# Altium schematic sheet 05_ZYNQ_BANK0_1_34_35.SchDoc
size A4; SheetNumber: 6; SheetTotal: 11
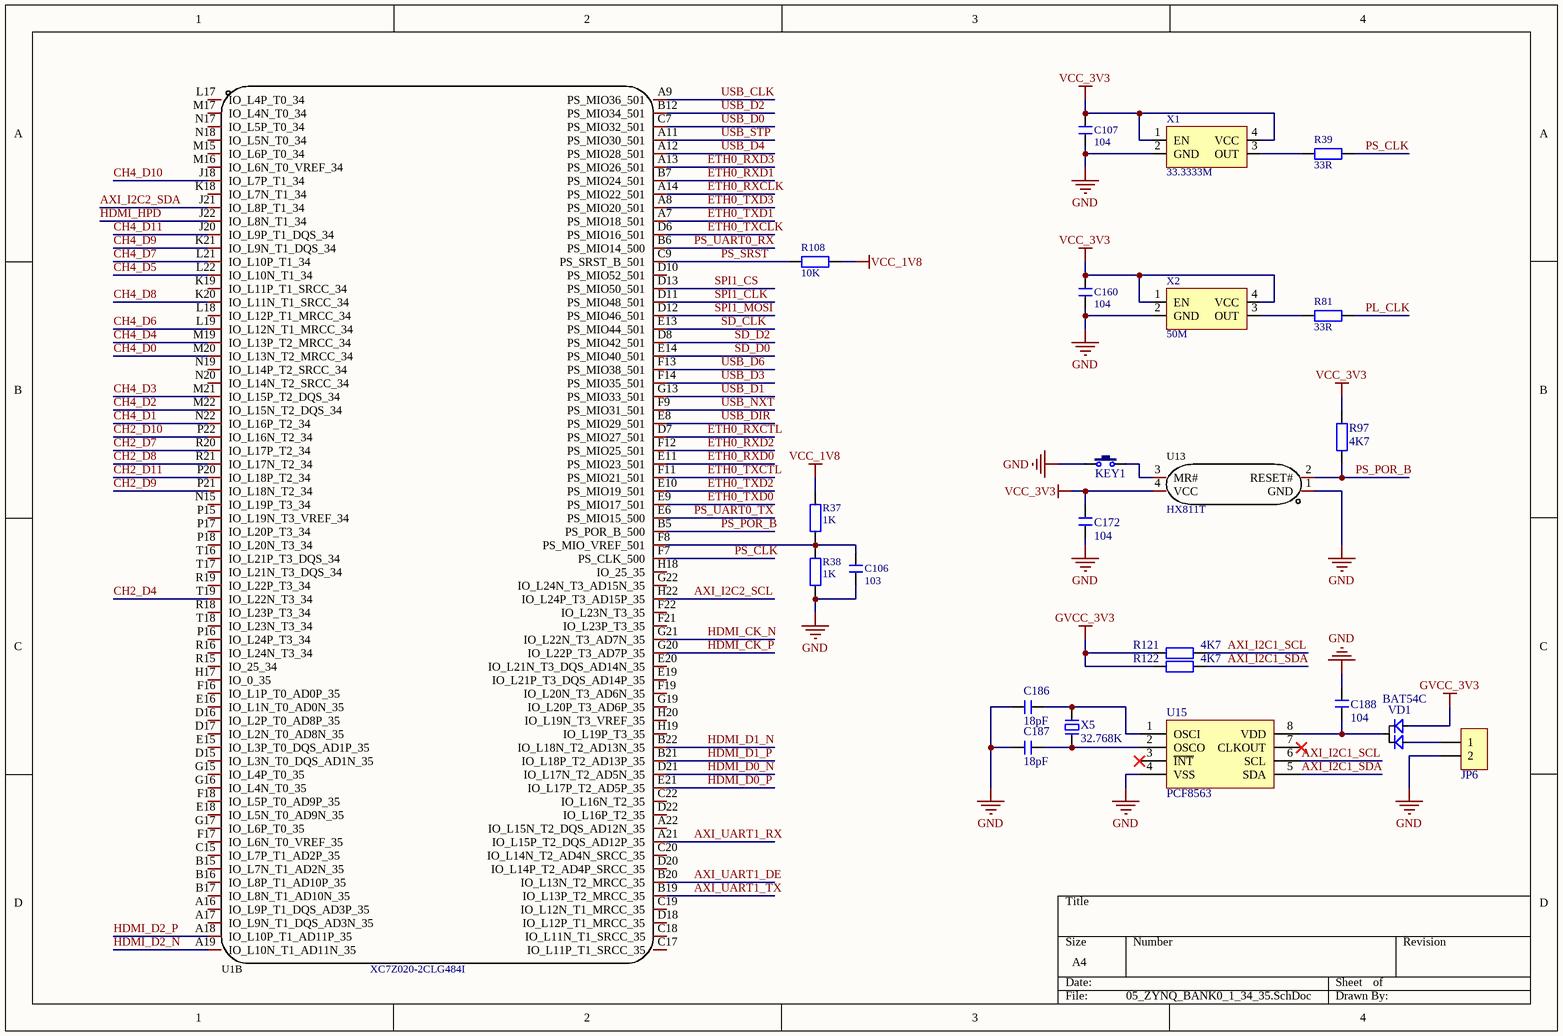
[diagram p0: 05_ZYNQ_BANK0_1_34_35.SchDoc]

## Parts
C106  103  [C 0402]
C107  104  [C 0402]
C160  104  [C 0402]
C172  104  [C 0402]
C186  18pF  [C 0603]
C187  18pF  [C 0603]
C188  104  [C 0603]
JP6  HDR-1X2  [SH1.0]  (value not drawn)
KEY1  KEY  [ButtonTACT_3x4x2_180]  (value not drawn)
R37  1K  [R 0402]
R38  1K  [R 0402]
R39  33R  [R 0402]
R81  33R  [R 0402]
R97  4K7  [R 0402]
R108  10K  [R 0402]
R121  4K7  [R 0603]
R122  4K7  [R 0603]
U1  XC7Z020-2CLG484I  [FPBGA-484_L19.0-W19.0-R22-C22-P0.80-BL]  (part B of 4)
U13  HX811T  [SOT143]
U15  PCF8563  [SOP8_N]
VD1  BAT54C  [SOT23-3N]
X1  33.3333M  [XTAL-3225 - S]
X2  50M  [XTAL-3225 - S]
X5  32.768K  [XTAL-3215]

## Nets
GND: C106.1 C107.1 C160.1 C172.1 C186.2 C187.2 C188.2 JP6.2 KEY1.1 R38.1 U13.1(GND) U15.4(VSS) X1.2(GND) X2.2(GND)
GVCC_3V3: R121.1 R122.1 VD1.2
VCC_1V8: R37.2 R108.1
VCC_3V3: C107.2 C160.2 C172.2 R97.2 U13.4(VCC) X1.1(EN) X1.4(VCC) X2.1(EN) X2.4(VCC)
AXI_I2C1_SCL: R121.2 U15.6(SCL)
AXI_I2C1_SDA: R122.2 U15.5(SDA)
AXI_I2C2_SCL: U1.H22(IO_L24P_T3_AD15P_35)
AXI_I2C2_SDA: U1.J21(IO_L8P_T1_34)
AXI_UART1_DE: U1.B20(IO_L13N_T2_MRCC_35)
AXI_UART1_RX: U1.A21(IO_L15P_T2_DQS_AD12P_35)
AXI_UART1_TX: U1.B19(IO_L13P_T2_MRCC_35)
CH2_D4: U1.T19(IO_L22N_T3_34)
CH2_D7: U1.R20(IO_L17P_T2_34)
CH2_D8: U1.R21(IO_L17N_T2_34)
CH2_D9: U1.P21(IO_L18N_T2_34)
CH2_D10: U1.P22(IO_L16N_T2_34)
CH2_D11: U1.P20(IO_L18P_T2_34)
CH4_D0: U1.M20(IO_L13N_T2_MRCC_34)
CH4_D1: U1.N22(IO_L16P_T2_34)
CH4_D2: U1.M22(IO_L15N_T2_DQS_34)
CH4_D3: U1.M21(IO_L15P_T2_DQS_34)
CH4_D4: U1.M19(IO_L13P_T2_MRCC_34)
CH4_D5: U1.L22(IO_L10N_T1_34)
CH4_D6: U1.L19(IO_L12N_T1_MRCC_34)
CH4_D7: U1.L21(IO_L10P_T1_34)
CH4_D8: U1.K20(IO_L11N_T1_SRCC_34)
CH4_D9: U1.K21(IO_L9N_T1_DQS_34)
CH4_D10: U1.J18(IO_L7P_T1_34)
CH4_D11: U1.J20(IO_L9P_T1_DQS_34)
ETH0_RXCLK: U1.A14(PS_MIO22_501)
ETH0_RXCTL: U1.D7(PS_MIO27_501)
ETH0_RXD0: U1.E11(PS_MIO23_501)
ETH0_RXD1: U1.B7(PS_MIO24_501)
ETH0_RXD2: U1.F12(PS_MIO25_501)
ETH0_RXD3: U1.A13(PS_MIO26_501)
ETH0_TXCLK: U1.D6(PS_MIO16_501)
ETH0_TXCTL: U1.F11(PS_MIO21_501)
ETH0_TXD0: U1.E9(PS_MIO17_501)
ETH0_TXD1: U1.A7(PS_MIO18_501)
ETH0_TXD2: U1.E10(PS_MIO19_501)
ETH0_TXD3: U1.A8(PS_MIO20_501)
HDMI_CK_N: U1.G21(IO_L22N_T3_AD7N_35)
HDMI_CK_P: U1.G20(IO_L22P_T3_AD7P_35)
HDMI_D0_N: U1.D21(IO_L17N_T2_AD5N_35)
HDMI_D0_P: U1.E21(IO_L17P_T2_AD5P_35)
HDMI_D1_N: U1.B22(IO_L18N_T2_AD13N_35)
HDMI_D1_P: U1.B21(IO_L18P_T2_AD13P_35)
HDMI_D2_N: U1.A19(IO_L10N_T1_AD11N_35)
HDMI_D2_P: U1.A18(IO_L10P_T1_AD11P_35)
HDMI_HPD: U1.J22(IO_L8N_T1_34)
PL_CLK: R81.2
PS_CLK: R39.2 U1.F7(PS_CLK_500)
PS_POR_B: R97.1 U1.B5(PS_POR_B_500) U13.2(RESET#)
PS_SRST: R108.2 U1.C9(PS_SRST_B_501)
PS_UART0_RX: U1.B6(PS_MIO14_500)
PS_UART0_TX: U1.E6(PS_MIO15_500)
SD_CLK: U1.E13(PS_MIO44_501)
SD_D0: U1.E14(PS_MIO40_501)
SD_D2: U1.D8(PS_MIO42_501)
SPI1_CLK: U1.D11(PS_MIO48_501)
SPI1_CS: U1.D13(PS_MIO50_501)
SPI1_MOSI: U1.D12(PS_MIO46_501)
USB_CLK: U1.A9(PS_MIO36_501)
USB_D0: U1.C7(PS_MIO32_501)
USB_D1: U1.G13(PS_MIO33_501)
USB_D2: U1.B12(PS_MIO34_501)
USB_D3: U1.F14(PS_MIO35_501)
USB_D4: U1.A12(PS_MIO28_501)
USB_D6: U1.F13(PS_MIO38_501)
USB_DIR: U1.E8(PS_MIO29_501)
USB_NXT: U1.F9(PS_MIO31_501)
USB_STP: U1.A11(PS_MIO30_501)
NetC106_2: C106.2 R37.1 R38.2 U1.F8(PS_MIO_VREF_501)
NetC186_1: C186.1 U15.1(OSCI) X5.1
NetC187_1: C187.1 U15.2(OSCO) X5.2
NetC188_1: C188.1 U15.8(VDD) VD1.3
NetJP6_1: JP6.1 VD1.1
NetKEY1_2: KEY1.2 U13.3(MR#)
NetR39_1: R39.1 X1.3(OUT)
NetR81_1: R81.1 X2.3(OUT)

Not connected (* = marked no-connect by the designer): U1 A16(IO_L9P_T1_DQS_AD3P_35) A17(IO_L9N_T1_DQS_AD3N_35) A22(IO_L15N_T2_DQS_AD12N_35) B15(IO_L7N_T1_AD2N_35) B16(IO_L8P_T1_AD10P_35) B17(IO_L8N_T1_AD10N_35) C15(IO_L7P_T1_AD2P_35) C17(IO_L11P_T1_SRCC_35) C18(IO_L11N_T1_SRCC_35) C19(IO_L12N_T1_MRCC_35) C20(IO_L14N_T2_AD4N_SRCC_35) C22(IO_L16N_T2_35) D10(PS_MIO52_501) D15(IO_L3N_T0_DQS_AD1N_35) D16(IO_L2P_T0_AD8P_35) D17(IO_L2N_T0_AD8N_35) D18(IO_L12P_T1_MRCC_35) D20(IO_L14P_T2_AD4P_SRCC_35) D22(IO_L16P_T2_35) E15(IO_L3P_T0_DQS_AD1P_35) E16(IO_L1N_T0_AD0N_35) E18(IO_L5N_T0_AD9N_35) E19(IO_L21P_T3_DQS_AD14P_35) E20(IO_L21N_T3_DQS_AD14N_35) F16(IO_L1P_T0_AD0P_35) F17(IO_L6N_T0_VREF_35) F18(IO_L5P_T0_AD9P_35) F19(IO_L20N_T3_AD6N_35) F21(IO_L23P_T3_35) F22(IO_L23N_T3_35) G15(IO_L4P_T0_35) G16(IO_L4N_T0_35) G17(IO_L6P_T0_35) G19(IO_L20P_T3_AD6P_35) G22(IO_L24N_T3_AD15N_35) H17(IO_0_35) H18(IO_25_35) H19(IO_L19P_T3_35) H20(IO_L19N_T3_VREF_35) K18(IO_L7N_T1_34) K19(IO_L11P_T1_SRCC_34) L17(IO_L4P_T0_34) L18(IO_L12P_T1_MRCC_34) M15(IO_L6P_T0_34) M16(IO_L6N_T0_VREF_34) M17(IO_L4N_T0_34) N15(IO_L19P_T3_34) N17(IO_L5P_T0_34) N18(IO_L5N_T0_34) N19(IO_L14P_T2_SRCC_34) N20(IO_L14N_T2_SRCC_34) P15(IO_L19N_T3_VREF_34) P16(IO_L24P_T3_34) P17(IO_L20P_T3_34) P18(IO_L20N_T3_34) R15(IO_25_34) R16(IO_L24N_T3_34) R18(IO_L23P_T3_34) R19(IO_L22P_T3_34) T16(IO_L21P_T3_DQS_34) T17(IO_L21N_T3_DQS_34) T18(IO_L23N_T3_34); U15 3(~{INT})* 7(CLKOUT)*

## Library data of the parts
C106 C107 C160 C172 C186-C188 = C: 无极性贴片电容; 版权归属: 源创客; BOM名称: 无极性贴片电容; 学习资源: www.ooocke.com
JP6 = Header 2: 2P接插件; 版权归属: 源创客; BOM名称: 2P接插件; 学习资源: www.ooocke.com
KEY1 = KEY: 按键; BOM名称: 3x6轻触开关; 版权归属: 源创客; 学习资源: www.ooocke.com
R37-R39 R81 R97 R108 R121 R122 = R: 贴片电阻; 版权归属: 源创客; BOM名称: 贴片电阻; 学习资源: www.ooocke.com
U1 = XC7Z020-2CLG484I: Manufacturer: XILINX(赛灵思); Add into BOM: yes; Paste Type: expand; Name: XC7Z020-2CLG484I; Symbol: XC7Z020-2CLG484I; Device: XC7Z020-2CLG484I; LCSC Part Name: XC7Z020-2CLG484I; Supplier Part: C157624; Manufacturer Part: XC7Z020-2CLG484I; Supplier Footprint: CSPBGA-484; JLCPCB Part Class: Extended Part; Datasheet: https://atta.szlcsc.com/upload/public/pdf/source/20180115/C157624_15160149665121269420.pdf; Supplier: LCSC; Convert to PCB: yes; Assembly Type: smtWeld
U13 = HX811T: Manufacturer: HX(恒佳兴); Add into BOM: yes; Name: HX811T; Symbol: HX811T; Device: HX811T; LCSC Part Name: 检测复位IC  HX811T; Supplier Part: C296128; Manufacturer Part: HX811T; Supplier Footprint: SOT-143; JLCPCB Part Class: Extended Part; Datasheet: https://atta.szlcsc.com/upload/public/pdf/source/20181119/C296128_6509B37C6407C6FF929C4891EE243D12.pdf; Supplier: LCSC; Convert to PCB: yes
VD1 = BAT54C: 肖特基二极管（双）
X1 X2 = XTAL-4P_S: 4脚有源晶振; BOM名称: 4脚晶振; 版权归属: 源创客; 学习资源: www.ooocke.com
X5 = XTAL-2P: 2脚无源晶振; BOM名称: 2脚晶振; 版权归属: 源创客; 学习资源: www.ooocke.com